# EAGLE design inputs (EAGLE 5.11)
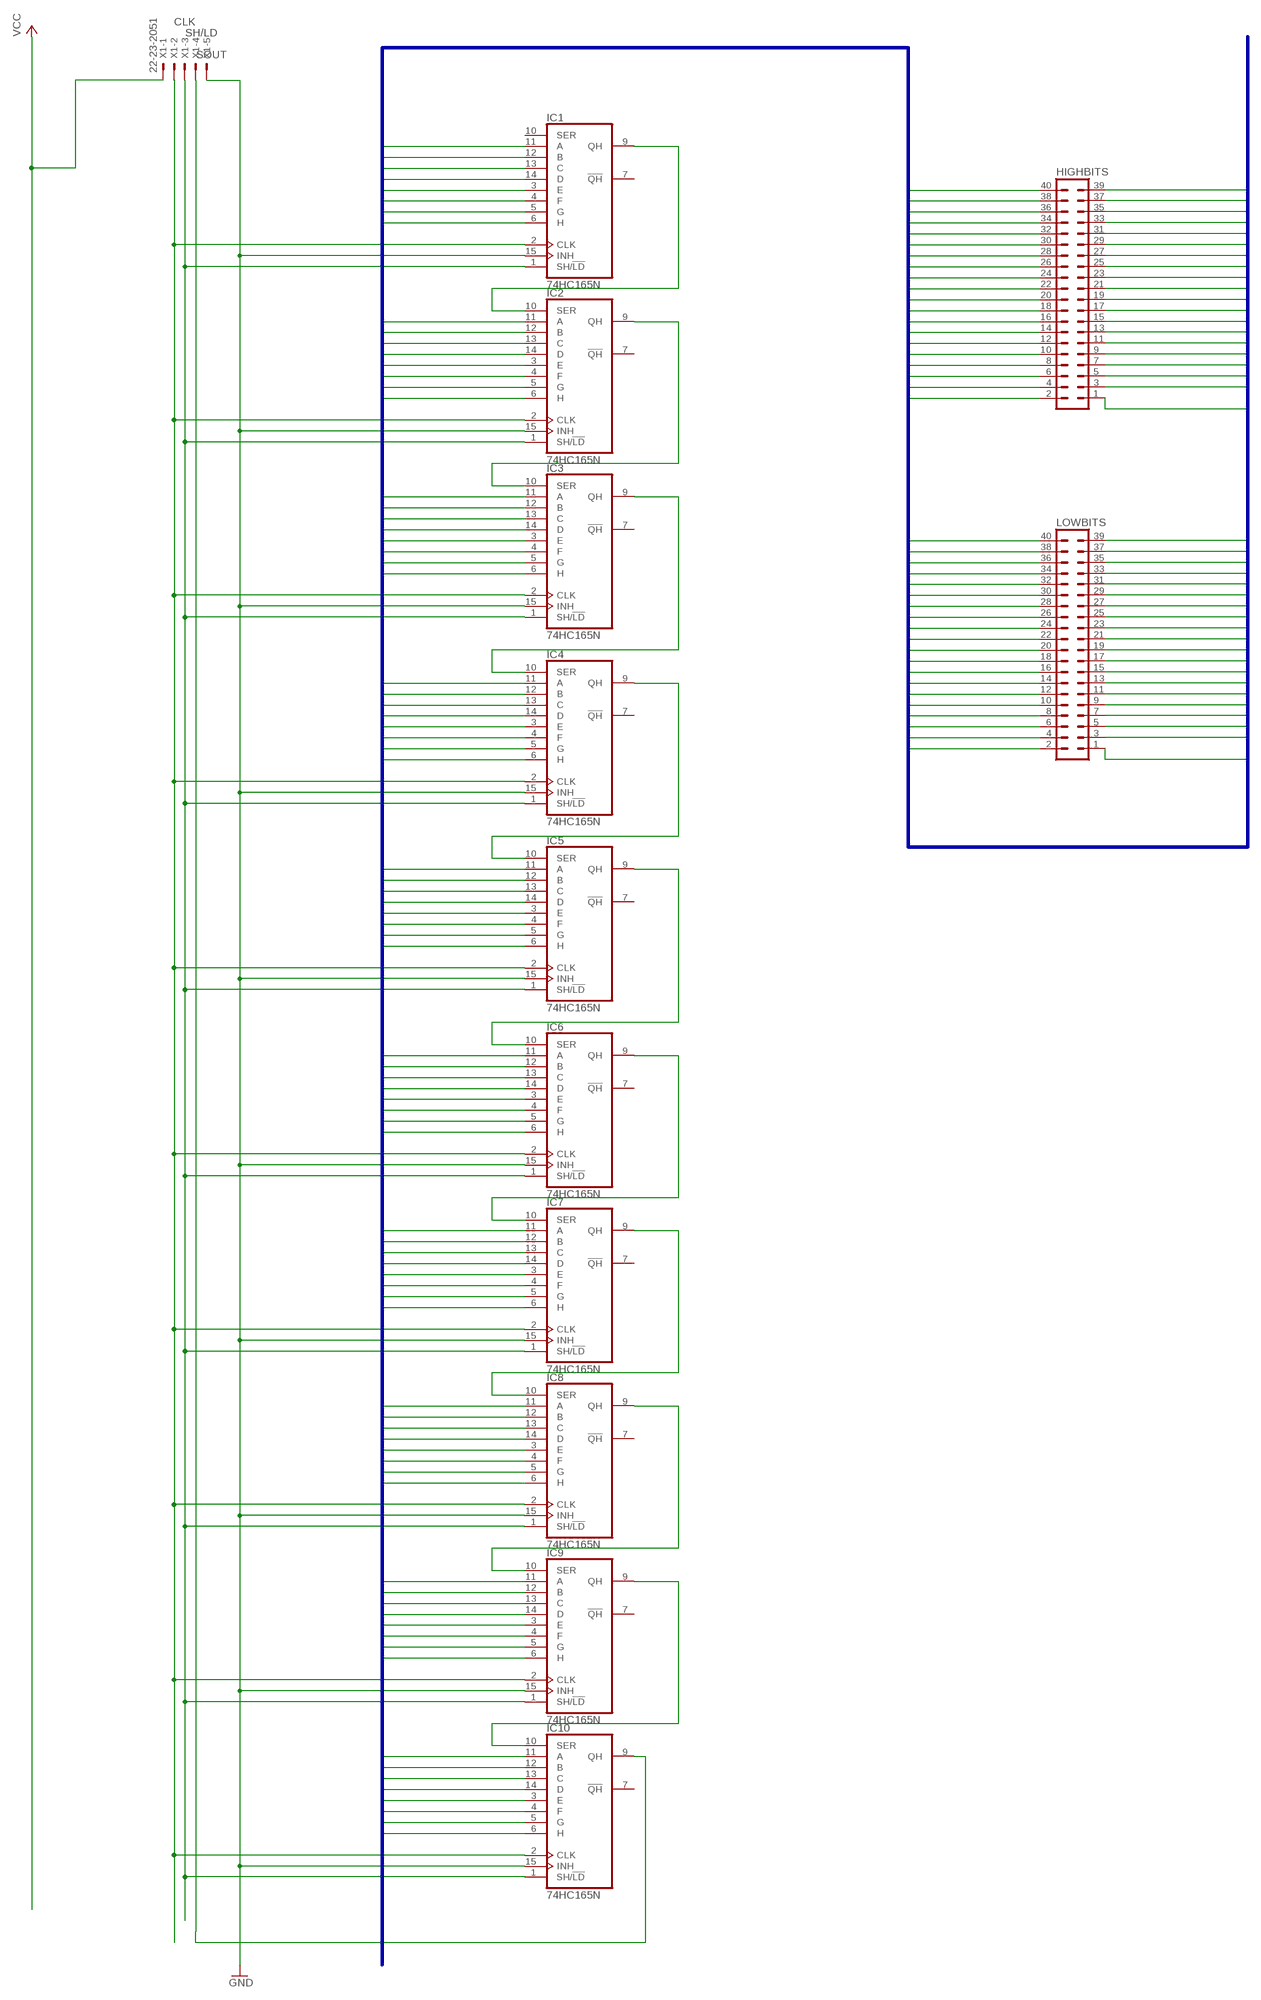
[diagram p0: schematic, sheet 1]

## Parts
HIGHBITS  MA20-2  [MA20-2]
IC1  74HC165N  [DIL16]
IC2  74HC165N  [DIL16]
IC3  74HC165N  [DIL16]
IC4  74HC165N  [DIL16]
IC5  74HC165N  [DIL16]
IC6  74HC165N  [DIL16]
IC7  74HC165N  [DIL16]
IC8  74HC165N  [DIL16]
IC9  74HC165N  [DIL16]
IC10  74HC165N  [DIL16]
LOWBITS  MA20-2  [MA20-2]
X1  22-23-2051  [22-23-2051]

## Nets
BITS1: IC10.6(H) LOWBITS.1
BITS2: IC10.5(G) LOWBITS.2
BITS3: IC10.4(F) LOWBITS.3
BITS4: IC10.3(E) LOWBITS.4
BITS5: IC10.14(D) LOWBITS.5
BITS6: IC10.13(C) LOWBITS.6
BITS7: IC10.12(B) LOWBITS.7
BITS8: IC10.11(A) LOWBITS.8
BITS9: IC9.6(H) LOWBITS.9
BITS10: IC9.5(G) LOWBITS.10
BITS11: IC9.4(F) LOWBITS.11
BITS12: IC9.3(E) LOWBITS.12
BITS13: IC9.14(D) LOWBITS.13
BITS14: IC9.13(C) LOWBITS.14
BITS15: IC9.12(B) LOWBITS.15
BITS16: IC9.11(A) LOWBITS.16
BITS17: IC8.6(H) LOWBITS.17
BITS18: IC8.5(G) LOWBITS.18
BITS19: IC8.4(F) LOWBITS.19
BITS20: IC8.3(E) LOWBITS.20
BITS21: IC8.14(D) LOWBITS.21
BITS22: IC8.13(C) LOWBITS.22
BITS23: IC8.12(B) LOWBITS.23
BITS24: IC8.11(A) LOWBITS.24
BITS25: IC7.6(H) LOWBITS.25
BITS26: IC7.5(G) LOWBITS.26
BITS27: IC7.4(F) LOWBITS.27
BITS28: IC7.3(E) LOWBITS.28
BITS29: IC7.14(D) LOWBITS.29
BITS30: IC7.13(C) LOWBITS.30
BITS31: IC7.12(B) LOWBITS.31
BITS32: IC7.11(A) LOWBITS.32
BITS33: IC6.6(H) LOWBITS.33
BITS34: IC6.5(G) LOWBITS.34
BITS35: IC6.4(F) LOWBITS.35
BITS36: IC6.3(E) LOWBITS.36
BITS37: IC6.14(D) LOWBITS.37
BITS38: IC6.13(C) LOWBITS.38
BITS39: IC6.12(B) LOWBITS.39
BITS40: IC6.11(A) LOWBITS.40
BITS41: HIGHBITS.1 IC5.6(H)
BITS42: HIGHBITS.2 IC5.5(G)
BITS43: HIGHBITS.3 IC5.4(F)
BITS44: HIGHBITS.4 IC5.3(E)
BITS45: HIGHBITS.5 IC5.14(D)
BITS46: HIGHBITS.6 IC5.13(C)
BITS47: HIGHBITS.7 IC5.12(B)
BITS48: HIGHBITS.8 IC5.11(A)
BITS49: HIGHBITS.9 IC4.6(H)
BITS50: HIGHBITS.10 IC4.5(G)
BITS51: HIGHBITS.11 IC4.4(F)
BITS52: HIGHBITS.12 IC4.3(E)
BITS53: HIGHBITS.13 IC4.14(D)
BITS54: HIGHBITS.14 IC4.13(C)
BITS55: HIGHBITS.15 IC4.12(B)
BITS56: HIGHBITS.16 IC4.11(A)
BITS57: HIGHBITS.17 IC3.6(H)
BITS58: HIGHBITS.18 IC3.5(G)
BITS59: HIGHBITS.19 IC3.4(F)
BITS60: HIGHBITS.20 IC3.3(E)
BITS61: HIGHBITS.21 IC3.14(D)
BITS62: HIGHBITS.22 IC3.13(C)
BITS63: HIGHBITS.23 IC3.12(B)
BITS64: HIGHBITS.24 IC3.11(A)
BITS65: HIGHBITS.25 IC2.6(H)
BITS66: HIGHBITS.26 IC2.5(G)
BITS67: HIGHBITS.27 IC2.4(F)
BITS68: HIGHBITS.28 IC2.3(E)
BITS69: HIGHBITS.29 IC2.14(D)
BITS70: HIGHBITS.30 IC2.13(C)
BITS71: HIGHBITS.31 IC2.12(B)
BITS72: HIGHBITS.32 IC2.11(A)
BITS73: HIGHBITS.33 IC1.6(H)
BITS74: HIGHBITS.34 IC1.5(G)
BITS75: HIGHBITS.35 IC1.4(F)
BITS76: HIGHBITS.36 IC1.3(E)
BITS77: HIGHBITS.37 IC1.14(D)
BITS78: HIGHBITS.38 IC1.13(C)
BITS79: HIGHBITS.39 IC1.12(B)
BITS80: HIGHBITS.40 IC1.11(A)
CLK: IC1.2(CLK) IC2.2(CLK) IC3.2(CLK) IC4.2(CLK) IC5.2(CLK) IC6.2(CLK) IC7.2(CLK) IC8.2(CLK) IC9.2(CLK) IC10.2(CLK) X1.2
GND: IC1.15(INH) IC2.15(INH) IC3.15(INH) IC4.15(INH) IC5.15(INH) IC6.15(INH) IC7.15(INH) IC8.15(INH) IC9.15(INH) IC10.15(INH) X1.5
N$3: IC1.9(QH) IC2.10(SER)
N$4: IC2.9(QH) IC3.10(SER)
N$5: IC3.9(QH) IC4.10(SER)
N$6: IC4.9(QH) IC5.10(SER)
N$7: IC5.9(QH) IC6.10(SER)
N$8: IC6.9(QH) IC7.10(SER)
N$9: IC7.9(QH) IC8.10(SER)
N$10: IC8.9(QH) IC9.10(SER)
N$11: IC9.9(QH) IC10.10(SER)
SH/LD: IC1.1(SH/!LD) IC2.1(SH/!LD) IC3.1(SH/!LD) IC4.1(SH/!LD) IC5.1(SH/!LD) IC6.1(SH/!LD) IC7.1(SH/!LD) IC8.1(SH/!LD) IC9.1(SH/!LD) IC10.1(SH/!LD) X1.3
SOUT: IC10.9(QH) X1.4
VCC: X1.1
Unconnected: IC1.7(!QH) IC1.10(SER) IC2.7(!QH) IC3.7(!QH) IC4.7(!QH) IC5.7(!QH) IC6.7(!QH) IC7.7(!QH) IC8.7(!QH) IC9.7(!QH) IC10.7(!QH)

## Buses
BITS[1..80]

## Power pins joined to a net without a drawn wire
GND: IC1.8(GND) IC2.8(GND) IC3.8(GND) IC4.8(GND) IC5.8(GND) IC6.8(GND) IC7.8(GND) IC8.8(GND) IC9.8(GND) IC10.8(GND)
VCC: IC1.16(VCC) IC2.16(VCC) IC3.16(VCC) IC4.16(VCC) IC5.16(VCC) IC6.16(VCC) IC7.16(VCC) IC8.16(VCC) IC9.16(VCC) IC10.16(VCC)

## Library data of the parts
HIGHBITS LOWBITS = con-lstb:MA20-2: PIN HEADER; OC_FARNELL: unknown; OC_NEWARK: unknown
IC1-IC10 = 74xx-eu:74*165: 8-bit parallel load SHIFT REGISTER
X1 = con-molex:22-23-2051: .100" (2.54mm) Center Header - 5 Pin; MF: MOLEX; MPN: 22-23-2051; OC_FARNELL: 1462952; OC_NEWARK: 38C9178

## Board
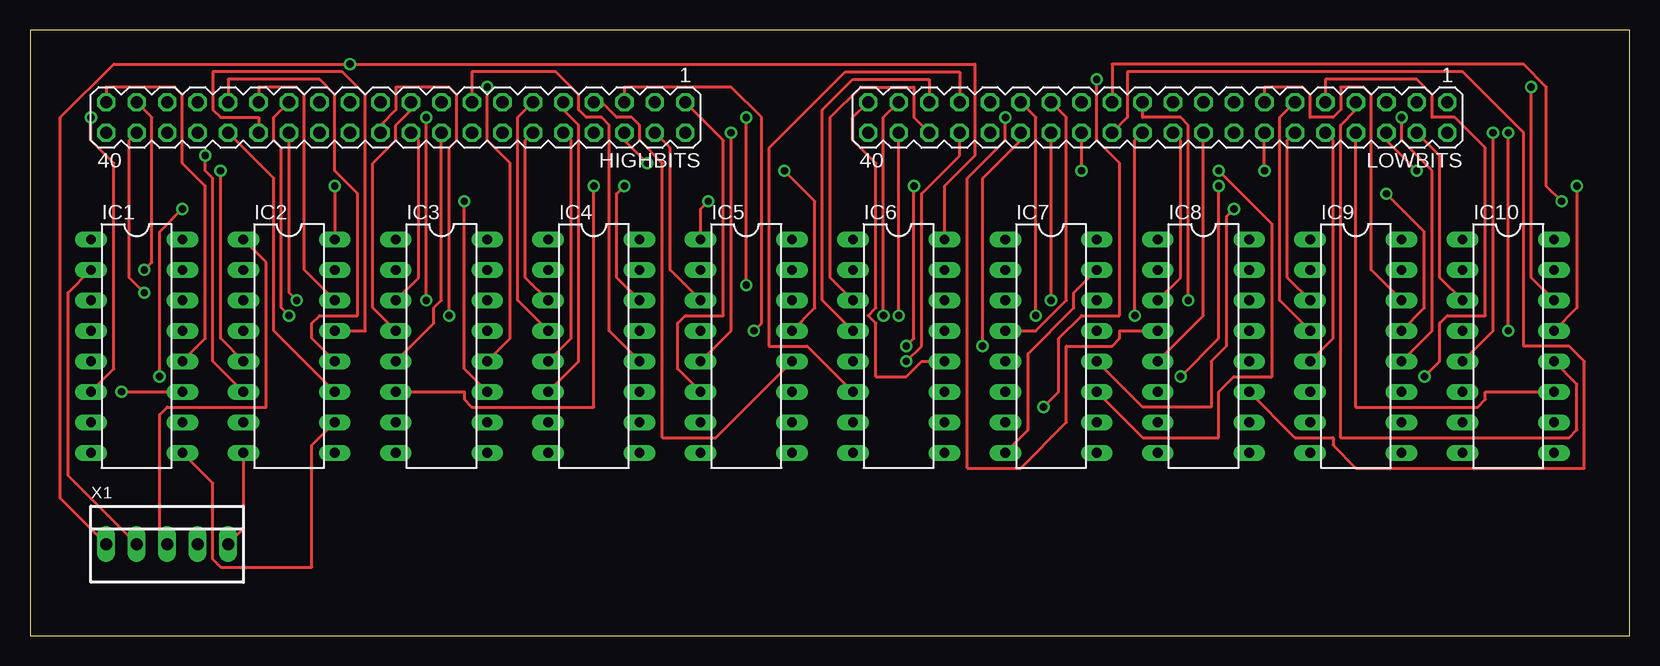
[diagram p1: board, top side]
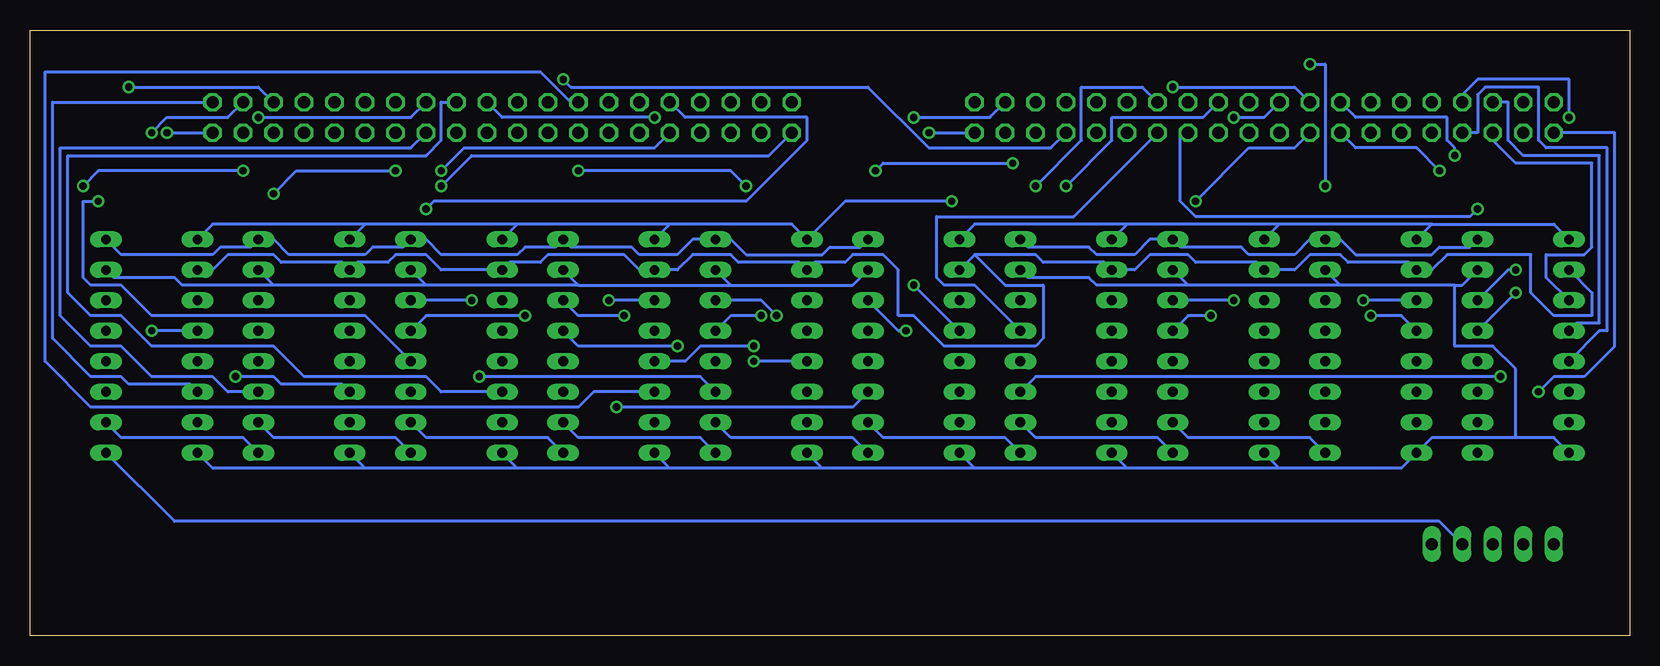
[diagram p2: board, bottom side, seen from below]

Size 133.33 x 50.47 mm. Coordinates in mm from the lower left corner, seen from the top.
Outline: 0,0 133.33,0 133.33,50.47 0,50.47 0,0
Copper layers (1*16): Top 0.035mm / dielectric 1.5mm / Bottom 0.035mm
Design rules "default": minimum track width 10mil, minimum drill 24mil, track to track 8mil, track to pad 8mil, pad to pad 8mil, via to via 8mil, smd to smd 8mil, copper to edge 40mil, drill to drill 8mil, minimum pad ring 10mil, minimum via ring 8mil, stop-mask expansion 4mil, vias tented up to drill 0mil, thermal gap 10mil

### Footprints (pad centres in the part's own frame; a part is rotated, then mirrored left to right if it is on the bottom)
MA20-2 = drill 1.016 octagon: 1 -24.13,-1.27; 2 -24.13,1.27; 3 -21.59,-1.27; 4 -21.59,1.27; 5 -19.05,-1.27; 6 -19.05,1.27; 7 -16.51,-1.27; 8 -16.51,1.27; 9 -13.97,-1.27; 10 -13.97,1.27; 11 -11.43,-1.27; 12 -11.43,1.27; 13 -8.89,-1.27; 14 -8.89,1.27; 15 -6.35,-1.27; 16 -6.35,1.27; 17 -3.81,-1.27; 18 -3.81,1.27; 19 -1.27,-1.27; 20 -1.27,1.27; 21 1.27,-1.27; 22 1.27,1.27; 23 3.81,-1.27; 24 3.81,1.27; 25 6.35,-1.27; 26 6.35,1.27; 27 8.89,-1.27; 28 8.89,1.27; 29 11.43,-1.27; 30 11.43,1.27; 31 13.97,-1.27; 32 13.97,1.27; 33 16.51,-1.27; 34 16.51,1.27; 35 19.05,-1.27; 36 19.05,1.27; 37 21.59,-1.27; 38 21.59,1.27; 39 24.13,-1.27; 40 24.13,1.27
DIL16 = drill 0.813 long: 1 -8.89,-3.81; 2 -6.35,-3.81; 3 -3.81,-3.81; 4 -1.27,-3.81; 5 1.27,-3.81; 6 3.81,-3.81; 7 6.35,-3.81; 8 8.89,-3.81; 9 8.89,3.81; 10 6.35,3.81; 11 3.81,3.81; 12 1.27,3.81; 13 -1.27,3.81; 14 -3.81,3.81; 15 -6.35,3.81; 16 -8.89,3.81
22-23-2051 = drill 1 long: 1 -5.08,0; 2 -2.54,0; 3 0,0; 4 2.54,0; 5 5.08,0

### Placement (x,y rotation side)
HIGHBITS  30.48,43.18 180 top
IC1  8.89,24.13 270 top
IC2  21.59,24.13 270 top
IC3  34.29,24.13 270 top
IC4  46.99,24.13 270 top
IC5  59.69,24.13 270 top
IC6  72.39,24.13 270 top
IC7  85.09,24.13 270 top
IC8  97.79,24.13 270 top
IC9  110.49,24.13 270 top
IC10  123.19,24.13 270 top
LOWBITS  93.98,43.18 180 top
X1  11.43,7.62 0 top

### Tracks (layer width: path | path; a pad name or v marks a point on that pad's centre or on a via)
BITS1
  Bottom 0.254: IC10.6 120.02,20.95 125.09,20.95 125.73,21.59 128.27,21.59 131.44,24.77 131.44,44.45 LOWBITS.1
BITS2  (via drill 0.61)
  Top 0.254: IC10.5 121.92,25.4 v121.92,41.91
  Bottom 0.254: v121.92,41.91 LOWBITS.2
BITS3  (via drill 0.61)
  Top 0.254: v123.19,25.4 v123.19,41.91
  Bottom 0.254: IC10.4 v123.19,25.4 | v123.19,41.91 121.92,43.18 116.84,43.18 LOWBITS.3
BITS4
  Top 0.254: IC10.3 117.47,29.84 117.47,40.01 LOWBITS.4
BITS5  (via drill 0.61)
  Top 0.254: IC10.14 125.09,29.84 v125.09,45.72
  Bottom 0.254: v125.09,45.72 114.3,45.72 LOWBITS.5
BITS6  (via drill 0.61)
  Top 0.254: IC10.13 128.91,27.3 v128.91,37.47 | v115.57,38.73 113.03,41.27 LOWBITS.6
  Bottom 0.254: v128.91,37.47 127.64,38.73 v115.57,38.73
BITS7
  Top 0.254: IC10.12 128.91,20.95 128.91,17.14 128.27,16.51 109.22,16.51 109.22,42.55 110.49,43.81 LOWBITS.7
BITS8
  Top 0.254: IC10.11 121.28,20.32 121.28,19.68 120.65,19.05 110.49,19.05 LOWBITS.8
BITS9  (via drill 0.61)
  Top 0.254: v116.2,21.59 117.47,22.86 117.47,26.04 118.11,26.67 121.28,26.67 121.28,40.64 118.75,43.18 116.84,43.18 116.84,45.09 115.57,46.35 107.95,46.35 LOWBITS.9
  Bottom 0.254: IC9.6 107.31,20.95 112.39,20.95 113.03,21.59 v116.2,21.59
BITS10
  Top 0.254: IC9.5 108.58,24.77 108.58,41.27 LOWBITS.10
BITS11
  Top 0.254: IC9.4 104.14,27.94 104.14,43.18 LOWBITS.11
BITS12
  Top 0.254: IC9.3 104.78,29.84 104.78,41.27 LOWBITS.12
BITS13
  Top 0.254: IC9.14 111.76,30.48 111.76,45.09 111.12,45.72 109.22,45.72 109.22,43.81 108.58,43.18 106.68,43.18 106.68,45.09 106.05,45.72 102.87,45.72 LOWBITS.13
BITS14  (via drill 0.61)
  Top 0.254: IC9.13 116.2,27.3 116.2,33.66 v113.03,36.83 | v102.87,38.73 LOWBITS.14
  Bottom 0.254: v113.03,36.83 111.12,38.73 v102.87,38.73
BITS15  (via drill 0.61)
  Top 0.254: IC9.12 116.84,25.4 116.84,38.73 114.3,41.27 v114.3,43.18
  Bottom 0.254: v114.3,43.18 101.6,43.18 LOWBITS.15
BITS16
  Bottom 0.254: IC9.11 116.84,20.32 118.11,21.59 123.19,21.59 125.73,24.13 128.27,24.13 130.81,26.67 130.81,40.64 101.6,40.64 LOWBITS.16
BITS17
  Bottom 0.254: IC8.6 99.06,20.32 100.33,21.59 110.49,21.59 113.03,24.13 123.19,24.13 125.73,26.67 128.27,26.67 130.18,28.57 130.18,40.01 100.33,40.01 99.06,41.27 99.06,44.45 LOWBITS.17
BITS18
  Top 0.254: IC8.5 97.79,26.67 LOWBITS.18
BITS19  (via drill 0.61)
  Top 0.254: IC8.4 90.81,25.4 90.81,24.77 90.17,24.13 86.36,24.13 86.36,17.78 82.55,13.97 78.11,13.97 78.11,38.1 81.28,41.27 v81.28,43.18
  Bottom 0.254: v81.28,43.18 93.98,43.18 LOWBITS.19
BITS20
  Top 0.254: IC8.3 95.89,29.84 95.89,41.27 LOWBITS.20
BITS21  (via drill 0.61)
  Top 0.254: v96.52,27.94 96.52,42.55 95.89,43.18 92.71,43.18 LOWBITS.21
  Bottom 0.254: v96.52,27.94 IC8.14
BITS22  (via drill 0.61)
  Top 0.254: v92.08,26.67 92.08,41.27 LOWBITS.22
  Bottom 0.254: IC8.13 100.33,26.67 v92.08,26.67
BITS23  (via drill 0.61)
  Top 0.254: v127.64,36.2 126.36,37.47 126.36,45.72 124.46,47.62 90.17,47.62 LOWBITS.23
  Bottom 0.254: IC8.12 105.41,26.67 123.19,26.67 125.73,29.21 128.27,29.21 128.91,29.84 128.91,36.2 v127.64,36.2
BITS24
  Top 0.254: IC8.11 105.41,16.51 108.58,16.51 108.58,15.88 110.49,13.97 129.54,13.97 129.54,22.86 128.27,24.13 124.46,24.13 124.46,41.91 119.38,46.99 91.44,46.99 91.44,43.18 LOWBITS.24
BITS25
  Bottom 0.254: IC7.6 86.36,20.32 87.63,19.05 128.27,19.05 132.08,22.86 132.08,46.99 90.81,46.99 88.27,44.45 LOWBITS.25
BITS26  (via drill 0.61)
  Top 0.254: v73.03,24.13 73.66,24.77 v73.66,37.47 | v87.63,38.73 LOWBITS.26
  Bottom 0.254: IC7.5 78.74,22.86 77.47,24.13 v73.03,24.13 | v73.66,37.47 74.93,38.73 v87.63,38.73
BITS27
  Top 0.254: IC7.4 83.82,25.4 86.36,27.94 86.36,43.18 LOWBITS.27
BITS28  (via drill 0.61)
  Top 0.254: v85.09,27.94 LOWBITS.28
  Bottom 0.254: IC7.3 v85.09,27.94
BITS29  (via drill 0.61)
  Top 0.254: v83.82,26.67 83.82,43.18 LOWBITS.29
  Bottom 0.254: IC7.14 87.63,26.67 v83.82,26.67
BITS30  (via drill 0.61)
  Top 0.254: v79.38,24.13 79.38,38.1 82.55,41.27 LOWBITS.30
  Bottom 0.254: IC7.13 87.63,24.13 v79.38,24.13
BITS31  (via drill 0.61)
  Top 0.254: IC7.12 92.71,19.05 98.42,19.05 98.42,22.86 99.69,24.13 99.69,34.92 v100.33,35.56
  Bottom 0.254: v100.33,35.56 99.69,36.2 73.66,36.2 68.58,41.27 68.58,43.18 78.74,43.18 LOWBITS.31
BITS32  (via drill 0.61)
  Top 0.254: IC7.11 92.71,16.51 99.06,16.51 99.06,20.32 100.33,21.59 103.5,21.59 103.5,34.29 v99.06,38.73
  Bottom 0.254: v99.06,38.73 97.16,40.64 81.28,40.64 LOWBITS.32
BITS33
  Top 0.254: IC6.6 64.77,24.13 61.59,24.13 61.59,40.64 67.94,46.99 77.47,46.99 LOWBITS.33
BITS34  (via drill 0.61)
  Top 0.254: v73.03,22.86 74.3,24.13 74.3,36.83 77.47,40.01 LOWBITS.34
  Bottom 0.254: IC6.5 v73.03,22.86
BITS35
  Top 0.254: IC6.4 66.04,27.94 66.04,43.81 68.58,46.35 74.93,46.35 LOWBITS.35
BITS36
  Top 0.254: IC6.3 66.67,29.84 66.67,43.18 69.22,45.72 73.66,45.72 73.66,43.18 LOWBITS.36
BITS37  (via drill 0.61)
  Top 0.254: v71.12,26.67 71.12,43.18 LOWBITS.37
  Bottom 0.254: IC6.14 72.39,27.94 v71.12,26.67
BITS38  (via drill 0.61)
  Top 0.254: v72.39,26.67 LOWBITS.38
  Bottom 0.254: IC6.13 74.93,26.67 v72.39,26.67
BITS39
  Top 0.254: IC6.12 74.3,22.86 73.03,21.59 70.48,21.59 70.48,26.04 69.85,26.67 70.48,27.3 70.48,39.37 68.58,41.27 68.58,43.18 LOWBITS.39
BITS40  (via drill 0.61)
  Top 0.254: v95.89,21.59 99.06,24.77 v99.06,37.47
  Bottom 0.254: IC6.11 77.47,21.59 v95.89,21.59 | v99.06,37.47 96.52,40.01 71.75,40.01 LOWBITS.40
BITS41
  Top 0.254: IC5.6 53.98,22.23 53.98,26.04 54.61,26.67 57.78,26.67 57.78,41.27 HIGHBITS.1
BITS42  (via drill 0.61)
  Top 0.254: IC5.5 58.42,25.4 v58.42,41.91
  Bottom 0.254: v58.42,41.91 HIGHBITS.2
BITS43  (via drill 0.61)
  Top 0.254: v59.69,29.21 v59.69,43.18
  Bottom 0.254: IC5.4 v59.69,29.21 | v59.69,43.18 53.34,43.18 HIGHBITS.3
BITS44
  Top 0.254: IC5.3 53.34,30.48 53.34,40.64 HIGHBITS.4
BITS45  (via drill 0.61)
  Top 0.254: v60.33,25.4 60.96,26.04 60.96,43.18 58.42,45.72 49.53,45.72 HIGHBITS.5
  Bottom 0.254: IC5.14 60.96,25.4 v60.33,25.4
BITS46  (via drill 0.61)
  Top 0.254: IC5.13 65.41,27.3 65.41,36.2 v62.87,38.73 | v51.44,39.37 49.53,41.27 HIGHBITS.6
  Bottom 0.254: v62.87,38.73 62.23,39.37 v51.44,39.37
BITS47
  Top 0.254: IC5.12 57.15,16.51 52.7,16.51 52.7,39.37 50.8,41.27 50.8,42.55 50.16,43.18 48.9,43.18 47.62,44.45 HIGHBITS.7
BITS48  (via drill 0.61)
  Top 0.254: v84.45,19.05 85.72,20.32 85.72,24.77 87.63,26.67 90.81,26.67 90.81,39.37 88.9,41.27 v88.9,46.35
  Bottom 0.254: IC5.11 64.77,19.05 v84.45,19.05 | v88.9,46.35 88.27,45.72 63.5,45.72 58.42,40.64 48.26,40.64 HIGHBITS.8
BITS49
  Top 0.254: IC4.6 45.72,22.86 45.72,42.55 44.45,43.81 HIGHBITS.9
BITS50
  Top 0.254: IC4.5 45.09,24.77 45.09,41.27 HIGHBITS.10
BITS51
  Top 0.254: IC4.4 40.64,27.94 40.64,43.18 HIGHBITS.11
BITS52
  Top 0.254: IC4.3 41.27,29.84 41.27,41.27 HIGHBITS.12
BITS53  (via drill 0.61)
  Top 0.254: IC4.14 48.9,29.84 48.9,36.83 v49.53,37.47
  Bottom 0.254: v49.53,37.47 45.72,41.27 45.72,45.72 40.64,45.72 HIGHBITS.13
BITS54
  Bottom 0.254: IC4.13 54.61,29.21 57.15,29.21 57.78,29.84 57.78,34.92 46.35,34.92 HIGHBITS.14
BITS55
  Top 0.254: IC4.12 48.26,25.4 48.26,42.55 47.62,43.18 46.35,43.18 45.72,43.81 45.72,45.09 43.81,46.99 36.83,46.99 HIGHBITS.15
BITS56  (via drill 0.61)
  Top 0.254: v10.79,21.59 10.79,33.66 v12.7,35.56
  Bottom 0.254: IC4.11 49.53,21.59 v10.79,21.59 | v12.7,35.56 13.34,34.92 36.2,34.92 37.47,36.2 37.47,41.91 HIGHBITS.16
BITS57  (via drill 0.61)
  Top 0.254: IC3.6 36.2,20.32 36.2,19.68 36.83,19.05 46.99,19.05 v46.99,37.47
  Bottom 0.254: v46.99,37.47 43.18,41.27 43.18,43.18 35.56,43.18 HIGHBITS.17
BITS58
  Top 0.254: IC3.5 33.66,26.04 33.66,27.3 34.29,27.94 HIGHBITS.18
BITS59
  Top 0.254: IC3.4 28.57,27.3 28.57,39.37 30.48,41.27 30.48,42.55 31.75,43.81 HIGHBITS.19
BITS60
  Top 0.254: IC3.3 32.38,29.84 32.38,41.27 HIGHBITS.20
BITS61  (via drill 0.61)
  Top 0.254: v33.02,27.94 v33.02,43.18
  Bottom 0.254: v33.02,27.94 IC3.14 | v33.02,43.18 30.48,43.18 HIGHBITS.21
BITS62  (via drill 0.61)
  Top 0.254: v34.92,26.67 34.92,40.64 35.56,41.27 35.56,45.09 34.92,45.72 30.48,45.72 30.48,43.81 29.21,42.55 HIGHBITS.22
  Bottom 0.254: IC3.13 36.83,26.67 v34.92,26.67
BITS63  (via drill 0.61)
  Top 0.254: IC3.12 40.01,24.77 40.01,39.37 38.1,41.27 v38.1,45.72
  Bottom 0.254: v38.1,45.72 27.94,45.72 HIGHBITS.23
BITS64  (via drill 0.61)
  Top 0.254: IC3.11 36.2,22.23 v36.2,36.2
  Bottom 0.254: v36.2,36.2 31.75,40.64 27.94,40.64 HIGHBITS.24
BITS65  (via drill 0.61)
  Top 0.254: IC2.6 15.24,22.86 15.24,38.1 14.61,38.73 v14.61,40.01
  Bottom 0.254: v14.61,40.01 14.61,40.64 15.24,41.27 15.24,43.18 22.86,43.18 HIGHBITS.25
BITS66  (via drill 0.61)
  Top 0.254: IC2.5 15.88,24.77 v15.88,38.73
  Bottom 0.254: v15.88,38.73 17.78,40.64 22.86,40.64 HIGHBITS.26
BITS67  (via drill 0.61)
  Top 0.254: v21.59,26.67 20.95,27.3 20.95,40.64 20.32,41.27 20.32,43.18 HIGHBITS.27
  Bottom 0.254: IC2.4 19.05,26.67 v21.59,26.67
BITS68  (via drill 0.61)
  Top 0.254: v22.23,27.94 21.59,28.57 HIGHBITS.28
  Bottom 0.254: IC2.3 v22.23,27.94
BITS69
  Top 0.254: IC2.14 22.86,30.48 22.86,45.09 22.23,45.72 19.05,45.72 HIGHBITS.29
BITS70
  Top 0.254: IC2.13 27.94,25.4 27.94,45.09 26.04,46.99 15.24,46.99 15.24,43.81 15.88,43.18 19.05,43.18 HIGHBITS.30
BITS71
  Top 0.254: IC2.12 23.5,24.77 23.5,26.04 24.13,26.67 27.3,26.67 27.3,36.83 25.4,38.73 25.4,45.09 24.13,46.35 16.51,46.35 HIGHBITS.31
BITS72
  Top 0.254: IC2.11 20.32,25.4 20.32,38.1 HIGHBITS.32
BITS73  (via drill 0.61)
  Top 0.254: IC1.6 6.99,22.23 6.99,39.37 5.08,41.27 v5.08,43.18
  Bottom 0.254: v5.08,43.18 5.08,46.35 12.7,46.35 13.97,45.09 HIGHBITS.33
BITS74
  Bottom 0.254: IC1.5 2.54,25.4 1.91,25.4 1.91,40.64 6.99,40.64 7.62,41.27 7.62,45.72 12.06,45.72 12.7,45.09 12.7,41.91 HIGHBITS.34
BITS75
  Bottom 0.254: IC1.4 4.45,26.04 2.54,26.04 2.54,40.01 8.89,40.01 10.16,41.27 10.16,44.45 HIGHBITS.35
BITS76
  Bottom 0.254: IC1.3 6.99,29.84 6.99,31.75 3.81,31.75 3.17,32.38 3.17,39.37 9.53,39.37 11.43,41.27 HIGHBITS.36
BITS77  (via drill 0.61)
  Top 0.254: v9.53,30.48 10.16,31.11 10.16,43.18 HIGHBITS.37
  Bottom 0.254: IC1.14 10.16,30.48 v9.53,30.48
BITS78  (via drill 0.61)
  Top 0.254: v9.53,28.57 8.26,29.84 8.26,41.27 HIGHBITS.38
  Bottom 0.254: v9.53,28.57 IC1.13
BITS79
  Top 0.254: IC1.12 14.61,24.77 14.61,37.47 12.7,39.37 12.7,45.09 12.06,45.72 6.35,45.72 HIGHBITS.39
BITS80  (via drill 0.61)
  Top 0.254: v7.62,20.32 IC1.11
  Bottom 0.254: v7.62,20.32 6.35,21.59 3.81,21.59 1.27,24.13 1.27,41.91 HIGHBITS.40
CLK
  Top 0.254: IC1.2 3.17,28.57 3.17,13.34 X1.2
  Bottom 0.254: IC10.2 118.11,30.48 116.84,31.75 113.03,31.75 112.39,31.11 107.31,31.11 IC9.2 106.05,31.11 103.5,31.11 102.87,31.75 100.33,31.75 99.06,30.48 IC8.2 93.34,31.11 90.81,31.11 90.17,31.75 83.82,31.75 82.55,30.48 IC7.2 79.38,30.48 78.11,31.75 74.93,31.75 74.3,31.11 69.22,31.11 IC6.2 67.94,31.11 65.41,31.11 64.77,31.75 62.23,31.75 60.96,30.48 60.96,26.67 59.69,26.67 57.15,24.13 49.53,24.13 48.9,24.77 48.9,29.21 52.07,29.21 54.61,31.75 | 54.61,31.75 49.53,31.75 48.9,31.11 43.81,31.11 IC4.2 41.27,30.48 40.01,31.75 36.83,31.75 36.2,31.11 31.11,31.11 IC3.2 27.94,30.48 26.67,31.75 24.13,31.75 23.5,31.11 18.41,31.11 IC2.2 16.51,30.48 15.24,31.75 8.26,31.75 8.26,28.57 6.35,26.67 3.17,26.67 3.17,28.57 IC1.2 | 54.61,31.75 IC5.2
GND
  Top 0.254: X1.5 17.78,8.89 IC2.8 | IC7.15 87,28.57 87,27.3 83.19,23.5 83.19,17.14 IC7.8
  Bottom 0.254: IC5.15 64.77,29.21 74.93,29.21 | 74.93,29.21 IC6.15 | IC7.15 87.63,29.21 | 87.63,29.21 74.93,29.21 | 100.33,29.21 IC8.15 | 87.63,29.21 100.33,29.21 | 113.03,29.21 IC9.15 | 100.33,29.21 113.03,29.21 | IC10.15 126.36,29.84 121.28,29.84 120.65,29.21 113.03,29.21 | IC1.15 13.97,29.21 14.61,29.21 | 14.61,29.21 24.13,29.21 | 24.13,29.21 IC2.15 | 36.83,29.21 IC3.15 | 24.13,29.21 36.83,29.21 | IC4.15 50.16,29.84 45.09,29.84 44.45,29.21 36.83,29.21 | IC1.8 6.35,16.51 9.53,16.51 | 9.53,16.51 16.51,16.51 IC2.8 19.05,13.97 29.21,13.97 | 29.21,13.97 IC3.8 | 41.91,13.97 IC4.8 | 29.21,13.97 41.91,13.97 | 54.61,13.97 IC5.8 | 41.91,13.97 54.61,13.97 | 67.31,13.97 IC6.8 | 54.61,13.97 67.31,13.97 | 80.01,13.97 IC7.8 | 67.31,13.97 80.01,13.97 | 92.71,13.97 IC8.8 | 80.01,13.97 92.71,13.97 | 105.41,13.97 IC9.8 | 92.71,13.97 105.41,13.97 | IC10.8 118.11,13.97 105.41,13.97 | 14.61,29.21 14.61,24.13 11.43,24.13 9.53,22.23 9.53,16.51
N$3
  Top 0.254: IC1.9 15.24,12.7 15.24,6.35 15.88,5.71 23.5,5.71 23.5,15.88 IC2.10
N$4
  Bottom 0.254: IC2.9 26.67,16.51 36.83,16.51 IC3.10
N$5
  Bottom 0.254: IC3.9 39.37,16.51 49.53,16.51 IC4.10
N$6
  Bottom 0.254: IC4.9 52.07,16.51 62.23,16.51 IC5.10
N$7
  Bottom 0.254: IC5.9 64.77,16.51 74.93,16.51 IC6.10
N$8
  Bottom 0.254: IC6.9 77.47,16.51 87.63,16.51 IC7.10
N$9
  Bottom 0.254: IC7.9 90.17,16.51 100.33,16.51 IC8.10
N$10
  Bottom 0.254: IC8.9 102.87,16.51 113.03,16.51 IC9.10
N$11
  Bottom 0.254: IC9.9 115.57,16.51 125.73,16.51 IC10.10
SH/LD  (via drill 0.61)
  Top 0.254: X1.3 10.79,8.26 10.79,18.41 11.43,19.05 19.68,19.05 19.68,31.11 IC2.1 | v56.52,36.2 55.88,35.56 IC5.1
  Bottom 0.254: 80.01,34.29 69.85,34.29 IC6.1 65.41,36.2 v56.52,36.2 | 80.01,34.29 IC7.1 | 92.71,34.29 IC8.1 | 80.01,34.29 92.71,34.29 | 105.41,34.29 IC9.1 | 92.71,34.29 105.41,34.29 | IC10.1 118.11,34.29 105.41,34.29 | IC1.1 6.35,34.29 16.51,34.29 | IC2.1 16.51,34.29 | 29.21,34.29 IC3.1 | 16.51,34.29 29.21,34.29 | 41.91,34.29 IC4.1 | 29.21,34.29 41.91,34.29 | IC5.1 54.61,34.29 41.91,34.29
SOUT
  Bottom 0.254: IC10.9 121.28,9.53 15.88,9.53 X1.4
VCC  (via drill 0.61)
  Top 0.254: X1.1 2.54,11.43 2.54,43.18 6.99,47.62 v26.67,47.62 78.74,47.62 78.74,40.01 76.2,37.47 IC6.16 | v25.4,37.47 IC2.16
  Bottom 0.254: IC10.16 125.73,31.75 118.11,31.75 117.47,32.38 114.94,32.38 IC9.16 113.03,33.02 111.76,31.75 105.41,31.75 104.78,32.38 102.23,32.38 IC8.16 100.33,33.02 99.06,31.75 92.71,31.75 92.08,32.38 89.53,32.38 IC7.16 88.27,32.38 83.19,32.38 82.55,31.75 79.38,31.75 78.11,33.02 IC6.16 74.93,33.02 73.66,31.75 67.31,31.75 66.67,32.38 64.14,32.38 IC5.16 | IC1.16 13.34,32.38 15.88,32.38 16.51,31.75 22.86,31.75 24.13,33.02 IC2.16 26.67,33.02 27.94,31.75 31.75,31.75 32.38,32.38 37.47,32.38 IC3.16 40.01,33.02 41.27,31.75 44.45,31.75 45.09,32.38 50.16,32.38 IC4.16 | v25.4,37.47 25.4,47.62 v26.67,47.62